# Altium schematic sheet house_sch.SchDoc
size A4
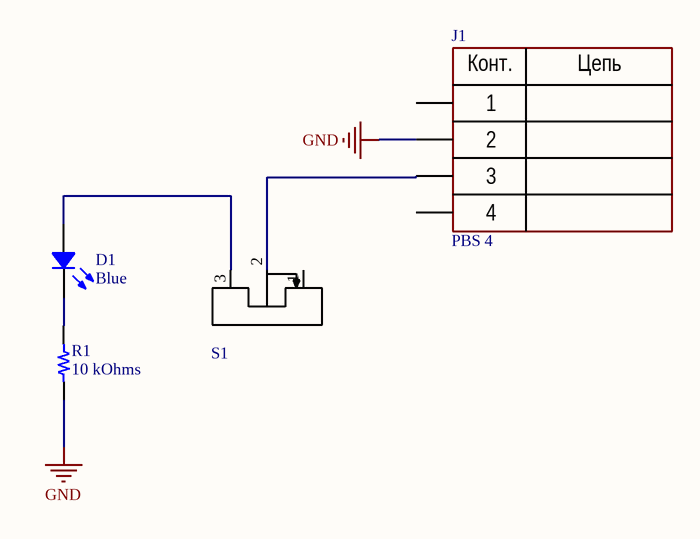
[diagram p0: house_sch.SchDoc]

## Parts
*  S1  [switcher]
D1  Blue  [LED 1206_3216 BLUE]
J1  PBS 4  [PBS-4 CUT]
R1  10 kOhms  [RES 0603_1608]

## Nets
GND: J1.2 R1.1
Net*_2: *.2 J1.3
Net*_3: *.3 D1.1
NetD1_2: D1.2 R1.2

Not connected (* = marked no-connect by the designer): * 1; J1 1 4

## Notes on the sheet
- (in symbol PBS 4) Конт.; Цепь

## Library data of the parts
* = switcher
D1 = SML-LXLC1206USBCTR: LED BLUE CLEAR SMD; Manufacturer: Lumex Opto/Components Inc.; Configuration: Standard; Current - Test: 20mA; Lens Color: Colorless; Lens Size: 1.60mm Dia; Lens Style: Round with Flat Top; Millicandela Rating: 250mcd; Viewing Angle: 70°; Voltage - Forward (Vf) (Typ): 3.3V; Wavelength - Peak: 460nm; Part Number: SML-LXLC1206USBCTR; Color: Blue; ComponentLink1Description: Datasheet; ComponentLink1URL: https://www.lumex.com/content/files/ProductAttachment/SML-LXLC1206USBCTR.pdf; ComponentLink2Description: DigiKey Link; ComponentLink2URL: http://digikey.com/product-detail/en/lumex-opto-components-inc/SML-LXLC1206USBCTR/67-2218-1-ND/4496785; Device Package: 1206 (3216 Metric); Height (Max): 1.10mm; LastUpdated: 21.01.2020 3:11:27; Lens Transparency: Clear; Lifecycle Status: Active; Minimum Order: 1; Mounting Type: Surface Mount; Package / Case: 1206 (3216 Metric); Packaging: TapeAndReel; PartId: 727; Part Status: Active; Price: 0.20; Series: -; Size / Dimension: 3.20mm L x 1.60mm W; Supplier 1: DigiKey; Supplier Part Number 1: 67-2218-1-ND; Supplier Device Package: SMD; Value: Blue
R1 = RNCS0603BKE10K0: RES 10K OHM 0.1% 1/16W 0603; Manufacturer: Stackpole Electronics Inc; Power (Watts): 0.063W, 1/16W; Temperature Coefficient: ±25ppm/°C; Part Number: RNCS0603BKE10K0; Value: 10 kOhms; ComponentLink1Description: Datasheet; ComponentLink1URL: https://www.seielect.com/catalog/sei-rncs_rnch.pdf; ComponentLink2Description: DigiKey Link; ComponentLink2URL: http://digikey.com/product-detail/en/stackpole-electronics-inc/RNCS0603BKE10K0/RNCS0603BKE10K0CT-ND/1800113; Composition: Thin Film; Device Package: 0603 (1608 Metric); Features: Anti-Corrosive, Automotive AEC-Q200, Moisture Resistant; Height - Seated (Max): 0.022" (0.55mm); LastUpdated: 21.01.2020 0:25:01; Lifecycle Status: Active; Minimum Order: 1; Number of Terminations: 2; Operating Temperature: -55°C ~ 155°C; Package / Case: 0603 (1608 Metric); Packaging: TapeAndReel; PartId: 4838; Part Status: Active; Price: 0.08; Ratings: AEC-Q200; Resistance: 10 kOhms; Series: RNCS; Size / Dimension: 0.061" L x 0.031" W (1.55mm x 0.80mm); Supplier 1: DigiKey; Supplier Part Number 1: RNCS0603BKE10K0CT-ND; Supplier Device Package: 0603; Tolerance: ±0.1%